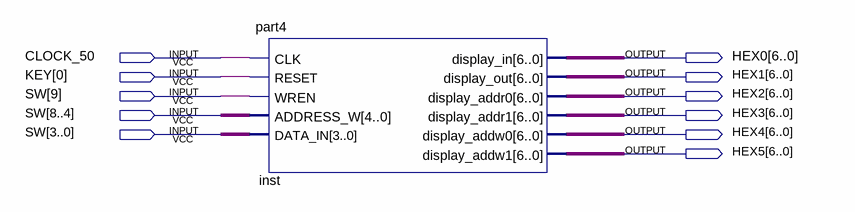
[diagram p0: schematic sheet]
// Quartus schematic Block4.bdf as structural Verilog: 1 symbols, 11 pins
module Block4 (
  input  CLOCK_50,
  input  [0:0] KEY,
  input  [9:0] SW,
  output [6:0] HEX0,
  output [6:0] HEX1,
  output [6:0] HEX2,
  output [6:0] HEX3,
  output [6:0] HEX4,
  output [6:0] HEX5
);

  part4 inst (
    .CLK(CLOCK_50), .RESET(KEY[0]), .WREN(SW[9]), .ADDRESS_W(SW[8:4]), .DATA_IN(SW[3:0]), .display_in(HEX0),
    .display_out(HEX1), .display_addr0(HEX2), .display_addr1(HEX3), .display_addw0(HEX4), .display_addw1(HEX5));
endmodule
